# Altium schematic sheet STM32_MCU.SchDoc
size A4; SheetNumber: 3; SheetTotal: 4
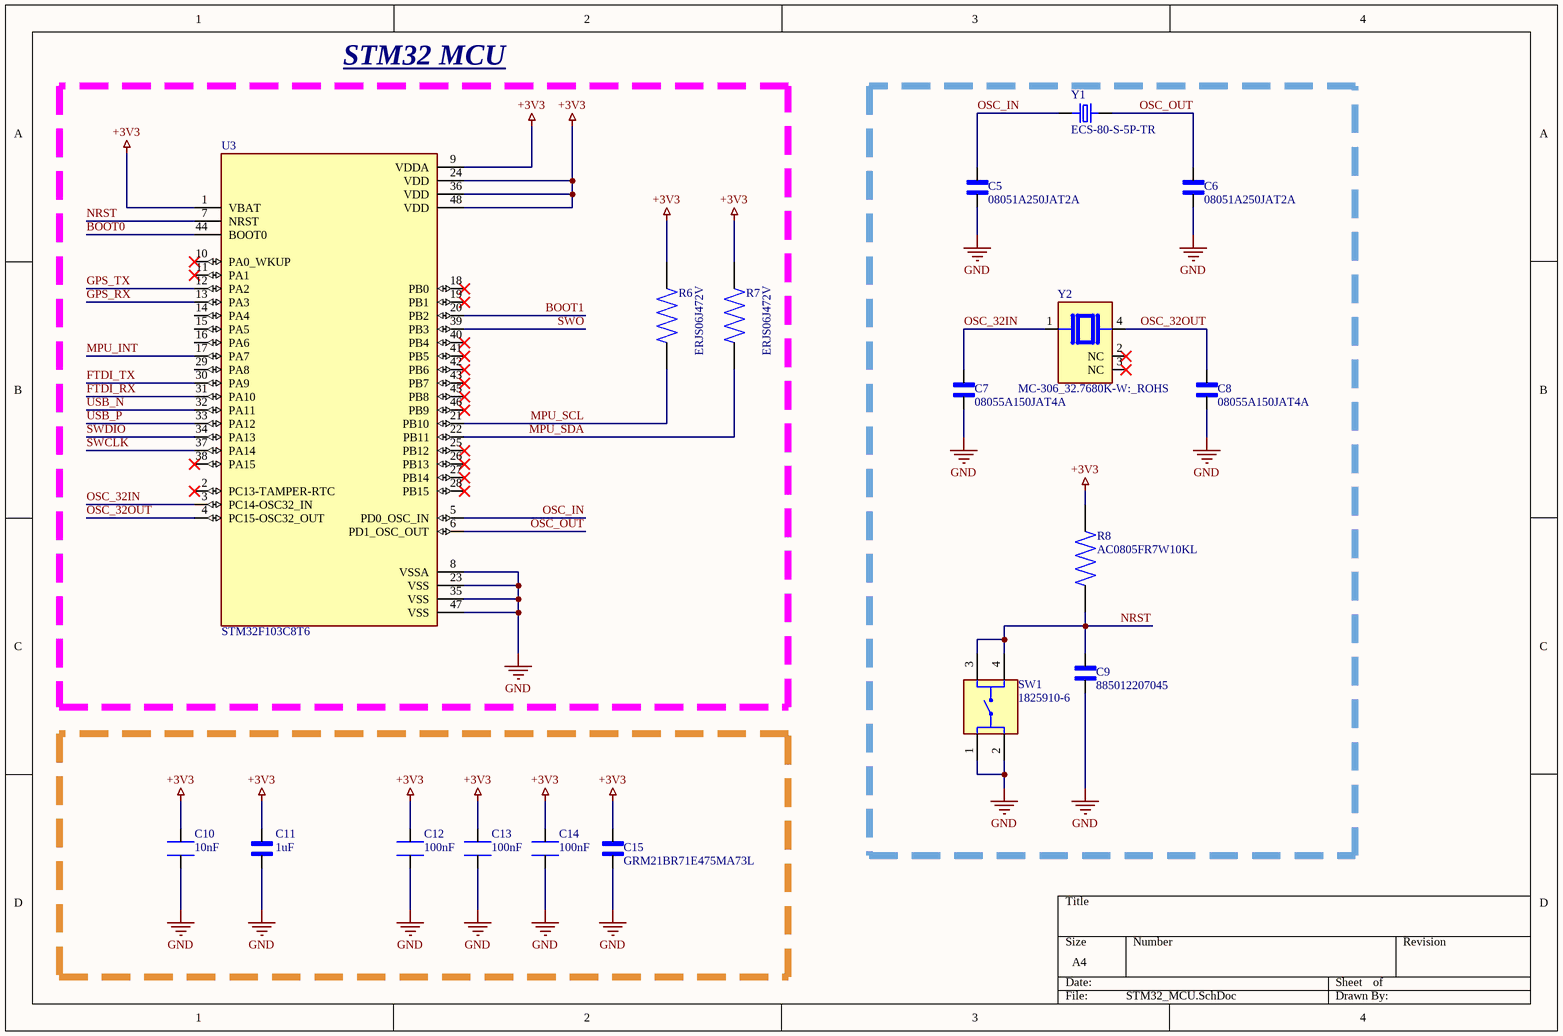
[diagram p0: STM32_MCU.SchDoc]

## Parts
C5  08051A250JAT2A  [CAPC2012X94N]
C6  08051A250JAT2A  [CAPC2012X94N]
C7  08055A150JAT4A  [CAPC2012X140N]
C8  08055A150JAT4A  [CAPC2012X140N]
C9  885012207045  [WCAP-CSGP_885012207045]
C10  value 10nF  [WCAP-CSST_885382207009]  (hidden comment: 885382207009)
C11  value 1uF  [CAPC2012X135N]  (hidden comment: GRM21BR71H105KA12L)
C12  value 100nF  [WCAP-CSST_885382207007]  (hidden comment: 885382207007)
C13  value 100nF  [WCAP-CSST_885382207007]  (hidden comment: 885382207007)
C14  value 100nF  [WCAP-CSST_885382207007]  (hidden comment: 885382207007)
C15  GRM21BR71E475MA73L  [CAPC2012X135N]
R6  ERJS06J472V  [RES_ERJS06J472V]
R7  ERJS06J472V  [RES_ERJS06J472V]
R8  AC0805FR7W10KL  [RESC2012X60N]
SW1  1825910-6  [SW_1825910-6-4]
U3  STM32F103C8T6  [QFP50P900X900X160-48N]
Y1  ECS-80-S-5P-TR  [XTAL_ECS-80-S-5P-TR]
Y2  MC-306_32.7680K-W:_ROHS  [XTAL_MC-306_32.7680K-W:_ROHS]

## Blocks framed on the sheet
STM32 MCU: R6 R7 U3

## Nets
+3V3: C10.2 C11.1 C12.2 C13.2 C14.2 C15.1 R6.2 R7.2 R8.2 U3.1(VBAT) U3.9(VDDA) U3.24(VDD) U3.36(VDD) U3.48(VDD)
GND: C5.1 C6.1 C7.2 C8.2 C9.1 C10.1 C11.2 C12.1 C13.1 C14.1 C15.2 SW1.1 SW1.2 U3.8(VSSA) U3.23(VSS) U3.35(VSS) U3.47(VSS)
BOOT0: U3.44(BOOT0)
BOOT1: U3.20(PB2)
FTDI_RX: U3.31(PA10)
FTDI_TX: U3.30(PA9)
GPS_RX: U3.13(PA3)
GPS_TX: U3.12(PA2)
MPU_INT: U3.17(PA7)
MPU_SCL: R6.1 U3.21(PB10)
MPU_SDA: R7.1 U3.22(PB11)
NRST: C9.2 R8.1 SW1.3 SW1.4 U3.7(NRST)
OSC_32IN: C7.1 U3.3(PC14-OSC32_IN) Y2.1
OSC_32OUT: C8.1 U3.4(PC15-OSC32_OUT) Y2.4
OSC_IN: C5.2 U3.5(PD0_OSC_IN) Y1.1
OSC_OUT: C6.2 U3.6(PD1_OSC_OUT) Y1.2
SWCLK: U3.37(PA14)
SWDIO: U3.34(PA13)
SWO: U3.39(PB3)
USB_N: U3.32(PA11)
USB_P: U3.33(PA12)

Not connected (* = marked no-connect by the designer): U3 2(PC13-TAMPER-RTC)* 10(PA0_WKUP)* 11(PA1)* 14(PA4) 15(PA5) 16(PA6) 18(PB0)* 19(PB1)* 25(PB12)* 26(PB13)* 27(PB14)* 28(PB15)* 29(PA8) 38(PA15)* 40(PB4)* 41(PB5)* 42(PB6)* 43(PB7)* 45(PB8)* 46(PB9)*; Y2 2(NC)* 3(NC)*

## Library data of the parts
C5 C6 = 08051A250JAT2A: Ceramic Multilayer Capacitor; Capacitor Type:General Purpose; Capacitance:25pF; Capacitance Tolerance:Â± 5%; Voltage Rating:100VDC; Capacitor Dielectric Type:Multilayer Ceramic; Package/Case:0805; Termination Type:SMD ;RoHS Compliant: Yes; MF: {'manufacturer': u'AVX'}; Package: None; Price: None; Value: *; MP: 08051A250JAT2A; Availability: Unavailable
C7 C8 = 08055A150JAT4A: Cap Ceramic 15pF 50V C0G 5% SMD 0805 125Â°C Paper T/R; MF: {'manufacturer': u'AVX'}; Package: None; Price: None; Value: *; MP: 08055A150JAT4A; Availability: Unavailable
C9 = 885012207045: <b> WCAP-CSGP Ceramic Capacitors <br> <br> <br><b>Characteristics </b><br> </b><br>Multilayer Ceramic Chip Capacitor <br>Recommended soldering:Reflow, for 0603 and 0805 wave soldering is also allowed <br>Operating temperature:-55 Â°C to +125 Â°C; <br>Ceramic characteristics: Class I - NPO ; Class II -X7R, X5R <br>High performance ceramic <br>High capacitance stability <br>Minimal aging  <br>Termination:Cu/Ni/Sn <br>   <br><a href="http://katalog.we-online.de/media/images/eisos/WCAP-CSGP_pf2.jpg" title="Enlarge picture"> <img src="http://katalog.we-online.de/media/thumbs2/eisos/thb_WCAP-CSGP_pf2.jpg" width="320"></a><p> Details see: <a href="http://katalog.we-online.de/en/pbs/WCAP-CSGP-0805?">http://katalog.we-online.de/en/pbs/WCAP-CSGP-0805? </a><p>Created:  2015-01-28 <br>2015 (C) Wurth Elektronik; MF: {'manufacturer': u'Wurth Electronics Inc'}; Package: None; Price: None; Value: *; MP: 885012207045; Availability: Unavailable
C10 = 885382207009: <b> WCAP-CSST Soft Termination MLCC <br> <br> <br><b>Characteristics </b><br> </b><br>Multilayer ceramic chip capacitors <br>Recommended soldering: Reflow <br>Operating temperature: -55 Â°C up to +125 Â°C <br>Capacitance range: 220 pF - 2.2 ÂµF <br>Rated voltage: 16 V(DC) up to 2 kV(DC) <br>Size: 0603, 0805, 1206 and 1210 <br>High absorbtion of mechanical stress   <br> <br> <br><b>Applications </b><br> <br>Application with high mechanical stress <br>Power supply <br>Lighting  <br> <br> <br><a href="https://katalog.we-online.de/media/images/v2/Family_WCAP-CSST.jpg" title="Enlarge picture"> <img src="https://katalog.we-online.de/media/images/v2/Family_WCAP-CSST.jpg" width="320"></a><p> Details see: <a href="https://katalog.we-online.de/en/pbs/WCAP-CSST#vs_ct:1">https://katalog.we-online.de/en/pbs/WCAP-CSST#vs_ct:1<br> <br></a><p>Created By Yingchun,Shan 2018-11-14 <br><br>20178(C) Wurth Elektronik; MF: {'manufacturer': u'Wurth Electronics Inc'}; Package: None; Price: None; MP: 885382207009; Availability: Unavailable
C11 = GRM21BR71H105KA12L: Cap Ceramic 1uF 50V X7R 10% SMD 0805 125Ã‚Â°C Embossed T/R; MF: {'manufacturer': u'Murata'}; Package: None; Price: None; MP: GRM21BR71H105KA12L; Availability: Unavailable
C12-C14 = 885382207007: <b> WCAP-CSST Soft Termination MLCC <br> <br> <br><b>Characteristics </b><br> </b><br>Multilayer ceramic chip capacitors <br>Recommended soldering: Reflow <br>Operating temperature: -55 Â°C up to +125 Â°C <br>Capacitance range: 220 pF - 2.2 ÂµF <br>Rated voltage: 16 V(DC) up to 2 kV(DC) <br>Size: 0603, 0805, 1206 and 1210 <br>High absorbtion of mechanical stress   <br> <br> <br><b>Applications </b><br> <br>Application with high mechanical stress <br>Power supply <br>Lighting  <br> <br> <br><a href="https://katalog.we-online.de/media/images/v2/Family_WCAP-CSST.jpg" title="Enlarge picture"> <img src="https://katalog.we-online.de/media/images/v2/Family_WCAP-CSST.jpg" width="320"></a><p> Details see: <a href="https://katalog.we-online.de/en/pbs/WCAP-CSST#vs_ct:1">https://katalog.we-online.de/en/pbs/WCAP-CSST#vs_ct:1<br> <br></a><p>Created By Yingchun,Shan 2018-11-14 <br><br>20178(C) Wurth Elektronik; MF: {'manufacturer': u'Wurth Electronics Inc'}; Package: None; Price: None; MP: 885382207007; Availability: Unavailable
C15 = GRM21BR71E475MA73L: CAP CER 4.7UF 25V X7R 0805; MF: {'manufacturer': u'Murata'}; Package: None; Price: None; Value: *; MP: GRM21BR71E475MA73L; Availability: Unavailable
R6 R7 = ERJS06J472V: MF: {'manufacturer': u'Panasonic'}; Package: None; Price: None; Value: *; MP: ERJS06J472V; Availability: Unavailable
R8 = AC0805FR7W10KL: RES SMD 18 OHM 5% 1/8W 0805; MF: {'manufacturer': u'Yageo Corporation'}; Package: None; Price: None; Value: *; MP: AC0805FR7W10KL; Availability: Unavailable
SW1 = 1825910-6: Switch Tactile OFF (ON) SPST Round Button PC Pins 0.05A 24VDC 100000Cycles 1.57N Thru-Hole Loose; MF: {'manufacturer': u'TE Connectivity'}; Package: None; Price: None; Value: *; MP: 1825910-6; Availability: Unavailable
U3 = STM32F103C8T6: Mainstream Performance line, ARM Cortex-M3 MCU with 64 Kbytes Flash, 72 MHz CPU, motor control, USB and CAN; MF: {'manufacturer': u'STMicroelectronics'}; Package: None; Price: None; Value: *; MP: STM32F103C8T6; Availability: Unavailable
Y1 = ECS-80-S-5P-TR: CRYSTAL SMD; MF: {'manufacturer': u'ECS International'}; Package: None; Price: None; Value: *; MP: ECS-80-S-5P-TR; Availability: Unavailable
Y2 = MC-306_32.7680K-W:_ROHS: MF: {'manufacturer': u'EPSON'}; MP: MC-306 32.7680K-W: ROHS; Package: None; Price: None; Value: *; Availability: Unavailable